# EAGLE design psvemmc-v20 (EAGLE 9.0.1)
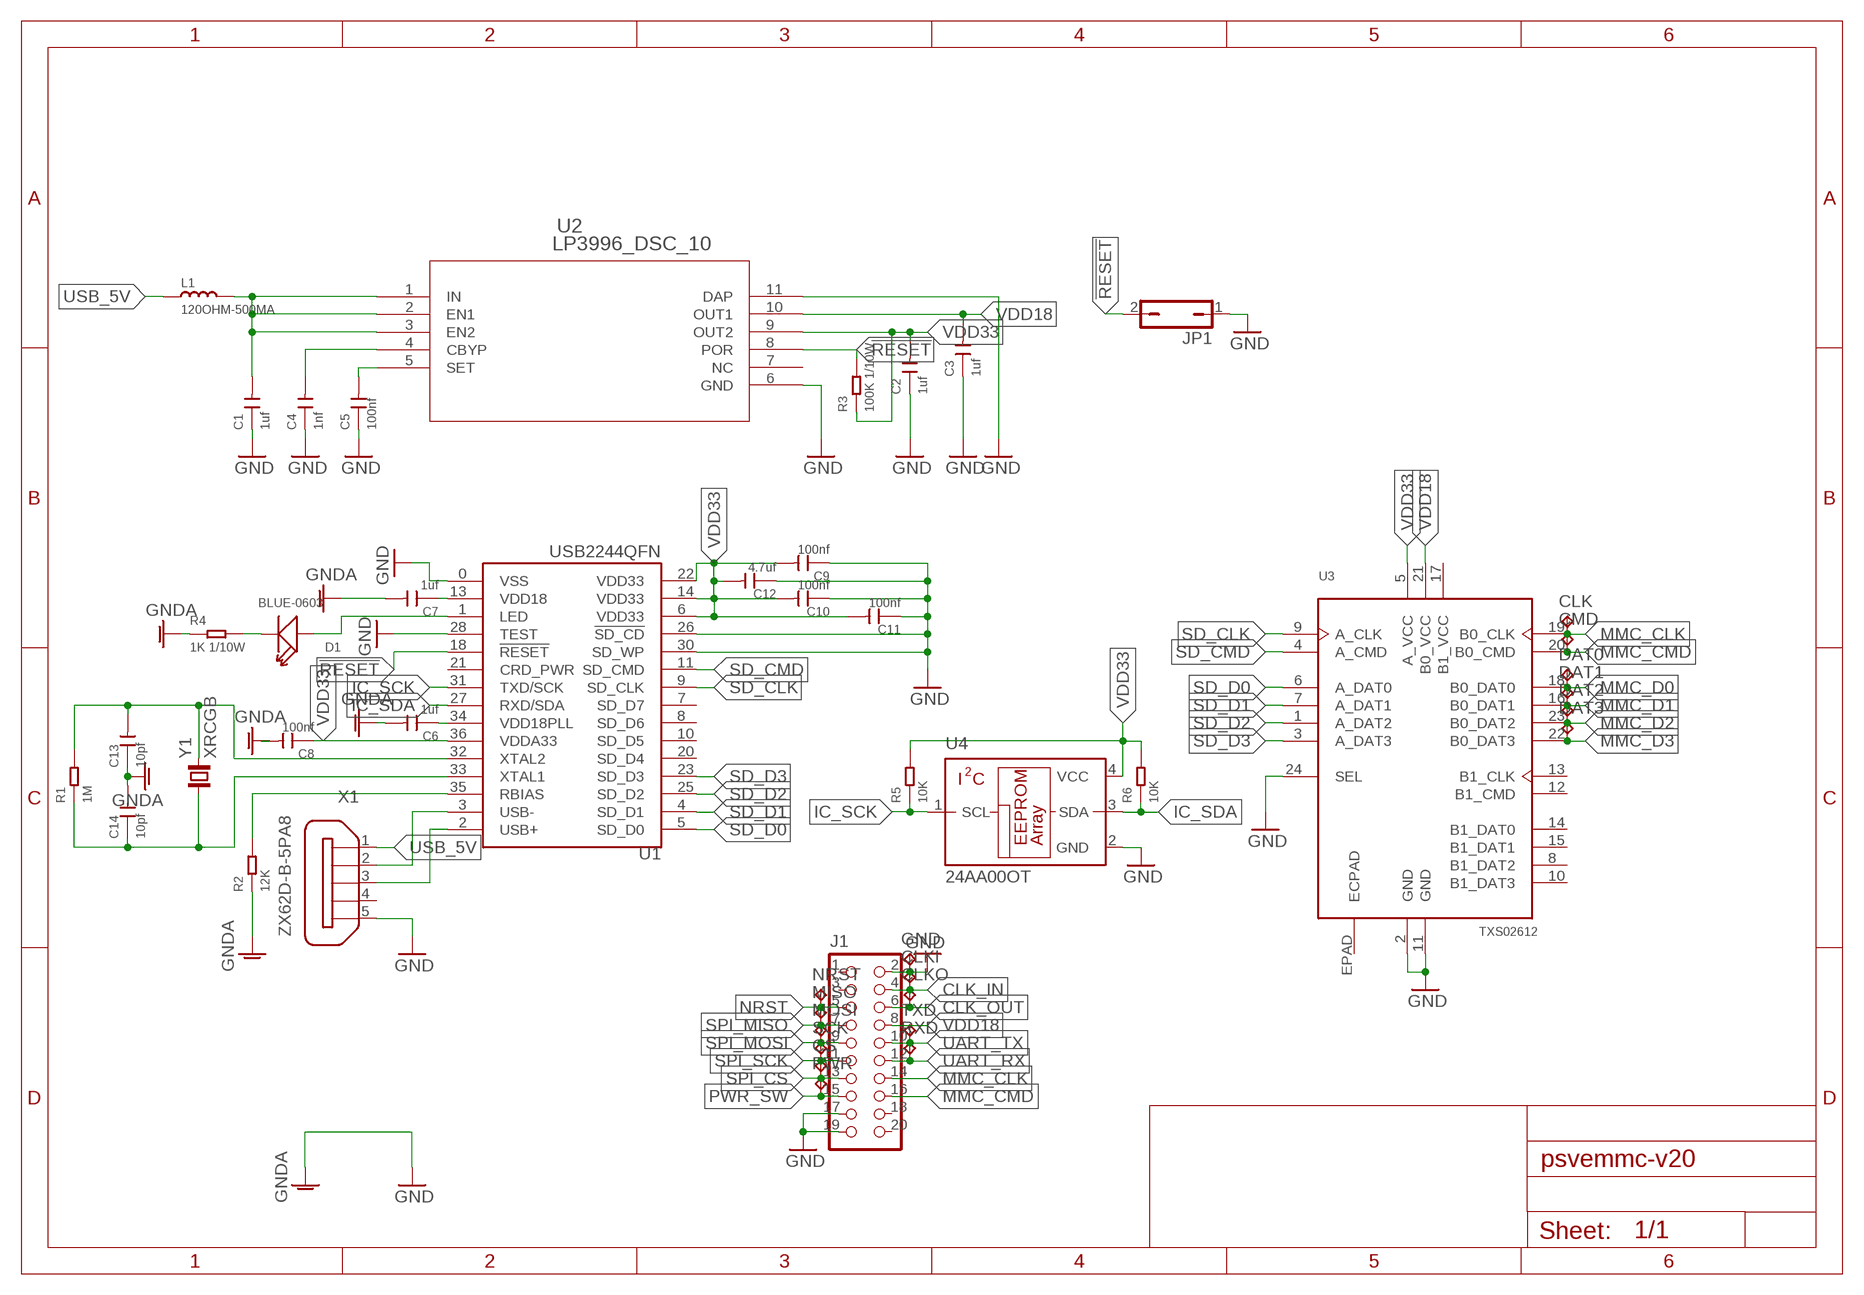
[diagram p0: schematic, sheet 1]

## Parts
C1  1uf  CERAMIC-1UF-25V-10%-X7R(0603)  [C0603]
C2  1uf  CERAMIC-1UF-25V-10%-X7R(0603)  [C0603]
C3  1uf  CERAMIC-1UF-25V-10%-X7R(0603)  [C0603]
C4  1nf  CERAMIC-1NF-50V-5%-C0G(0603)  [C0603]
C5  100nf  CERAMIC-100NF-50V-10%-X7R(0603)  [C0603]
C6  1uf  CERAMIC-1UF-25V-10%-X7R(0603)  [C0603]
C7  1uf  CERAMIC-1UF-25V-10%-X7R(0603)  [C0603]
C8  100nf  CERAMIC-100NF-50V-10%-X7R(0603)  [C0603]
C9  100nf  CERAMIC-100NF-50V-10%-X7R(0603)  [C0603]
C10  100nf  CERAMIC-100NF-50V-10%-X7R(0603)  [C0603]
C11  100nf  CERAMIC-100NF-50V-10%-X7R(0603)  [C0603]
C12  4.7uf  CERAMIC-4.7UF-10V-10%-X5R(0603)  [C0603]
C13  10pf  CERAMIC-10PF-50V-5%-NPO(0603)  [C0603]
C14  10pf  CERAMIC-10PF-50V-5%-NPO(0603)  [C0603]
CLK  TPTP10R  [TP10R]
CLKI  TPTP10R  [TP10R]
CLKO  TPTP10R  [TP10R]
CMD  TPTP10R  [TP10R]
CS  TPTP10R  [TP10R]
D1  BLUE-0603  SMD-LED-CLEAR-BLUE(0603)  [LED-0603]
DAT0  TPTP10R  [TP10R]
DAT1  TPTP10R  [TP10R]
DAT2  TPTP10R  [TP10R]
DAT3  TPTP10R  [TP10R]
GND  TPTP10R  [TP10R]
J1  CON_HEADER_2X10-SHROUDED  [PINSHRD_PTH_2X10]
JP1  JP1Q  [JP1]
L1  120OHM-500MA  SMD-FERRITE-CHIP-120-OHM-500MA(0603)  [L0603]
MISO  TPTP10R  [TP10R]
MOSI  TPTP10R  [TP10R]
NRST  TPTP10R  [TP10R]
PWR  TPTP10R  [TP10R]
R1  1M  SMD-RES-1M-1%-1/10W(0603)  [R0603]
R2  12K  SMD-RES-12K-1%-1/10W(0603)  [R0603]
R3  100K 1/10W  SMD-RES-100K-5%-1/10W(0603)  [R0603]
R4  1K 1/10W  SMD-RES-1K-5%-1/10W(0603)  [R0603]
R5  10K  SMD-RES-10K-1%-1/10W(0603)  [R0603]
R6  10K  SMD-RES-10K-1%-1/10W(0603)  [R0603]
RXD  TPTP10R  [TP10R]
SCK  TPTP10R  [TP10R]
TXD  TPTP10R  [TP10R]
U1  USB2244QFN  [QFN36]
U2  LP3996_DSC_10  [SDA10A]
U3  TXS02612  [S-PWQFN-N24]
U4  24AA00OT  [SOT23-5L]
X1  ZX62D-B-5PA8  [ZX62D-B-5PA8]
Y1  XRCGB  [XRCGB]

## Nets
!RESET: JP1.2 R3.2 U1.18(!RESET) U2.8(POR)
CLK_IN: CLKI.TP J1.4
CLK_OUT: CLKO.TP J1.6
GND [GND]: C1.1 C2.1 C3.1 C4.1 C5.1 C6.2 C7.2 C8.2 C9.1 C10.1 C11.1 C12.1 C13.1 C14.2 GND.TP J1.2 J1.17 J1.19 JP1.1 R2.1 R4.1 U1.0(VSS) U1.26(!SD_CD) U1.28(TEST) U1.30(SD_WP) U2.6(GND) U2.11(DAP) U3.2(GND) U3.11(GND) U3.24(SEL) U4.2(GND) X1.5 ; supply symbol labelled GNDA
IC_SCK: R5.1 U1.31(TXD/SCK) U4.1(SCL)
IC_SDA: R6.1 U1.27(RXD/SDA) U4.3(SDA)
LED: D1.+ U1.1(LED)
LED_M: D1.- R4.2
MMC_CLK: CLK.TP J1.14 U3.19(B0_CLK)
MMC_CMD: CMD.TP J1.16 U3.20(B0_CMD)
MMC_D0: DAT0.TP U3.18(B0_DAT0)
MMC_D1: DAT1.TP U3.16(B0_DAT1)
MMC_D2: DAT2.TP U3.23(B0_DAT2)
MMC_D3: DAT3.TP U3.22(B0_DAT3)
N$2: C4.2 U2.4(CBYP)
NRST: J1.5 NRST.TP
PWR_SW: J1.15 PWR.TP
RBIAS: R2.2 U1.35(RBIAS)
SD_CLK: U1.9(SD_CLK) U3.9(A_CLK)
SD_CMD: U1.11(SD_CMD) U3.4(A_CMD)
SD_D0: U1.5(SD_D0) U3.6(A_DAT0)
SD_D1: U1.4(SD_D1) U3.7(A_DAT1)
SD_D2: U1.25(SD_D2) U3.1(A_DAT2)
SD_D3: U1.23(SD_D3) U3.3(A_DAT3)
SET: C5.2 U2.5(SET)
SPI_CS: CS.TP J1.13
SPI_MISO: J1.7 MISO.TP
SPI_MOSI: J1.9 MOSI.TP
SPI_SCK: J1.11 SCK.TP
UART_RX: J1.12 RXD.TP
UART_TX: J1.10 TXD.TP
USB_5V: L1.1 X1.1
USB_M [USB]: U1.3(USB-) X1.2
USB_P [USB]: U1.2(USB+) X1.3
VDD5: C1.2 L1.2 U2.1(IN) U2.2(EN1) U2.3(EN2)
VDD18: C3.2 J1.8 U2.10(OUT1) U3.21(B0_VCC)
VDD18_PLL: C6.1 U1.34(VDD18PLL)
VDD18_USB: C7.1 U1.13(VDD18)
VDD33: C2.2 C8.1 C9.2 C10.2 C11.2 C12.2 R3.1 R5.2 R6.2 U1.6(VDD33) U1.14(VDD33) U1.22(VDD33) U1.36(VDDA33) U2.9(OUT2) U3.5(A_VCC) U4.4(VCC)
XTAL1: C14.1 R1.1 U1.33(XTAL1) Y1.1
XTAL2: C13.2 R1.2 U1.32(XTAL2) Y1.3
Unconnected: J1.1 J1.3 J1.18 J1.20 U1.7(SD_D7) U1.8(SD_D6) U1.10(SD_D5) U1.20(SD_D4) U1.21(CRD_PWR) U2.7(NC) U3.8(B1_DAT2) U3.10(B1_DAT3) U3.12(B1_CMD) U3.13(B1_CLK) U3.14(B1_DAT0) U3.15(B1_DAT1) X1.4 X1.S1 X1.S2 X1.S3 X1.S4

## Power pins joined to a net without a drawn wire
B1_VCC: U3.17(B1_VCC)
ECPAD: U3.EPAD(ECPAD)

## Library data of the parts
C1-C3 C6 C7 = Seeed-Capacitor:CERAMIC-1UF-25V-10%-X7R(0603): 302010139; MPN: CC0603KRX7R8BB105
C4 = Seeed-Capacitor:CERAMIC-1NF-50V-5%-C0G(0603): 302010341; MPN: GRM1885C1H102JA01D
C5 C8-C11 = Seeed-Capacitor:CERAMIC-100NF-50V-10%-X7R(0603): 302010138; MPN: CC0603KRX7R9BB104
C12 = Seeed-Capacitor:CERAMIC-4.7UF-10V-10%-X5R(0603): 302010111; MPN: CC0603KRX5R6BB475
C13 C14 = Seeed-Capacitor:CERAMIC-10PF-50V-5%-NPO(0603): 302010097; MPN: CC0603JRNPO9BN100
CLK CLKI CLKO CMD CS DAT0 DAT1-DAT3 GND MISO MOSI NRST PWR RXD SCK TXD = testpad:TP: Test pad
D1 = Seeed-LED:SMD-LED-CLEAR-BLUE(0603): 304090045; MPN: 19-217-BHC-ZL1M2RY-3T
J1 = dp_devices.v6:CON_HEADER_2X10
JP1 = jumper:JP1Q: JUMPER
L1 = Seeed-Inductor:SMD-FERRITE-CHIP-120-OHM-500MA(0603): 303030001; MPN: BLM18AG121SN1D
R1 = Seeed-Resistor:SMD-RES-1M-1%-1/10W(0603): 301010151; MPN: RC0603FR-071ML
R2 = Seeed-Resistor:SMD-RES-12K-1%-1/10W(0603): 301010102; MPN: RC0603FR-0712KL
R3 = Seeed-Resistor:SMD-RES-100K-5%-1/10W(0603): 301010089; MPN: RC0603JR-07100KL
R4 = Seeed-Resistor:SMD-RES-1K-5%-1/10W(0603): 301010291; MPN: RC0603JR-071KL
R5 R6 = Seeed-Resistor:SMD-RES-10K-1%-1/10W(0603): 301010299; MPN: RC0603FR-0710KL
U1 = USB2244:USB2244: USB2244/USB2244I
U2 = LP3996:LP3996_DSC_10; BASE_PN: LP3996; COMP: TypeLDO; LIBRARY: ReferenceLP3996SD; PARTNUMBER: LP3996SD0833; PIN: Count10; SYMBOL: NameLP3996SD0833; TYPE: LP3996SD0833; VENDOR: NationalSemiconductor; VERSION: 1
U3 = TXS02612:TXS02612
U4 = microchip:24*00: Serial EEPROM 128 bit, I2C (AA = 1.8 V/LC = 2.5 V/C = 5.0 V); MF: MICROCHIP; MPN: 24AA00T-I/OTG; OC_FARNELL: 1331264; OC_NEWARK: 89H3038
X1 = zx62d-b-5pa8-oshpark_10:ZX62D-B-5PA8: Micro USB Type B Connector - Standard, Shell Through Hole Source: http://www.hirose.co.jp/cataloge_hp/ed_ZX_20140804.pdf; MF: Hirose; MPN: ZX62D-B-5PA8; OC_FARNELL: 2300438; OC_NEWARK: 69W0712
Y1 = crystal:XRCGB: CRYSTAL

## Board
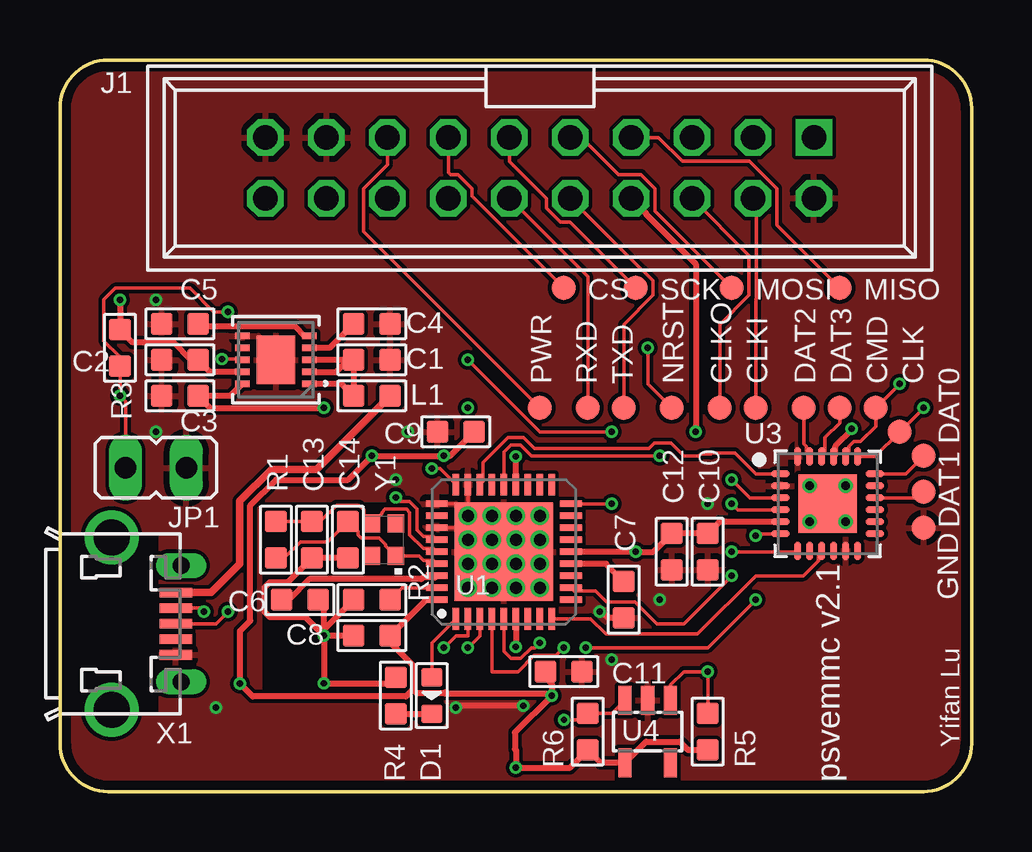
[diagram p1: board, top side]
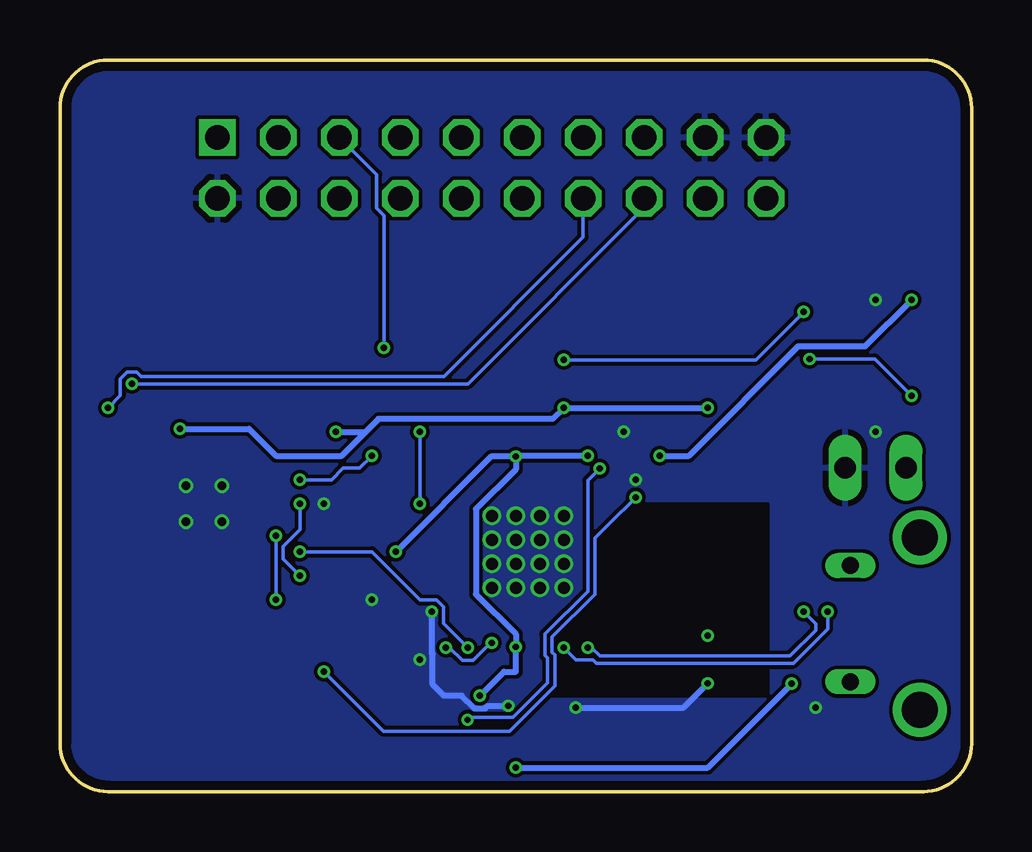
[diagram p2: board, bottom side, seen from below]

Size 38 x 30.5 mm. Coordinates in mm from the lower left corner, seen from the top.
Outline: 0,20.5 0,2
Outline: 0,2 0,28.5 arc-90 2,30.5 36,30.5 arc-90 38,28.5 38,2 arc-90 36,0 2,0 arc-90 0,2
Copper layers (1*16): Top 0.035559375mm / dielectric 1.6mm / Bottom 0.035559375mm
Design rules "oshpark-2layer *": minimum track width 6mil, minimum drill 10mil, track to track 6mil, track to pad 6mil, pad to pad 6mil, via to via 6mil, smd to smd 6mil, copper to edge 15mil, drill to drill 6mil, minimum pad ring 5mil, minimum via ring 5mil, stop-mask expansion 2.5mil, vias tented up to drill 0mil, thermal gap 10mil
tKeepout: area 33,2 to 36,9

### Footprints (pad centres in the part's own frame; a part is rotated, then mirrored left to right if it is on the bottom)
C0603 = smd 0.889 x 0.889: 1 0,0.762; 2 0,-0.762
TP10R = smd 1 x 1: TP 0,0
LED-0603 = smd 0.762 x 0.889: + -0.762,0; - 0.762,0
PINSHRD_PTH_2X10 = drill 1.016 square: 1 -11.43,-1.27 | drill 1.016 octagon: 2 -11.43,1.27; 3 -8.89,-1.27; 4 -8.89,1.27; 5 -6.35,-1.27; 6 -6.35,1.27; 7 -3.81,-1.27; 8 -3.81,1.27; 9 -1.27,-1.27; 10 -1.27,1.27; 11 1.27,-1.27; 12 1.27,1.27; 13 3.81,-1.27; 14 3.81,1.27; 15 6.35,-1.27; 16 6.35,1.27; 17 8.89,-1.27; 18 8.89,1.27; 19 11.43,-1.27; 20 11.43,1.27
JP1 = drill 0.914 long: 1 0,-1.27; 2 0,1.27
L0603 = smd 0.889 x 0.889: 1 -0.762,0; 2 0.762,0
R0603 = smd 0.889 x 0.889: 1 0,0.762; 2 0,-0.762
QFN36 = smd 4.1 x 4.1: 0 0,0 | smd 0.28 x 0.9: 1 -2,-2.8; 2 -1.5,-2.8; 3 -1,-2.8; 4 -0.5,-2.8; 5 0,-2.8; 6 0.5,-2.8; 7 1,-2.8; 8 1.5,-2.8; 9 2,-2.8; 19 2,2.8; 20 1.5,2.8; 21 1,2.8; 22 0.5,2.8; 23 0,2.8; 24 -0.5,2.8; 25 -1,2.8; 26 -1.5,2.8; 27 -2,2.8 | smd 0.9 x 0.28: 10 2.8,-2; 11 2.8,-1.5; 12 2.8,-1; 13 2.8,-0.5; 14 2.8,0; 15 2.8,0.5; 16 2.8,1; 17 2.8,1.5; 18 2.8,2; 28 -2.8,2; 29 -2.8,1.5; 30 -2.8,1; 31 -2.8,0.5; 32 -2.8,0; 33 -2.8,-0.5; 34 -2.8,-1; 35 -2.8,-1.5; 36 -2.8,-2
SDA10A = smd 0.61 x 0.254: 1 -1.397,1; 2 -1.397,0.5; 3 -1.397,0; 4 -1.397,-0.5; 5 -1.397,-1; 6 1.397,-1; 7 1.397,-0.5; 8 1.397,0; 9 1.397,0.5; 10 1.397,1 | smd 1.6 x 2.007: 11 0,0
S-PWQFN-N24 = smd 0.78 x 0.28: 1 -1.975,1.25; 2 -1.975,0.75; 3 -1.975,0.25; 4 -1.975,-0.25; 5 -1.975,-0.75; 6 -1.975,-1.25; 13 1.975,-1.25; 14 1.975,-0.75; 15 1.975,-0.25; 16 1.975,0.25; 17 1.975,0.75; 18 1.975,1.25 | smd 0.28 x 0.78: 7 -1.25,-1.975; 8 -0.75,-1.975; 9 -0.25,-1.975; 10 0.25,-1.975; 11 0.75,-1.975; 12 1.25,-1.975; 19 1.25,1.975; 20 0.75,1.975; 21 0.25,1.975; 22 -0.25,1.975; 23 -0.75,1.975; 24 -1.25,1.975 | smd 2.45 x 2.45: EPAD 0,0
SOT23-5L = smd 0.55 x 1.2: 1 -0.95,-1.3; 2 0,-1.3; 3 0.95,-1.3; 4 0.95,1.3; 5 -0.95,1.3
ZX62D-B-5PA8 = smd 1.35 x 0.4: 1 4.825,1.3; 2 4.825,0.65; 3 4.825,0; 4 4.825,-0.65; 5 4.825,-1.3 | drill 1.5: S1 2.15,-3.6; S2 2.15,3.6 | drill 0.7 long: S3 5.05,2.425; S4 5.05,-2.425
XRCGB = smd 0.75 x 0.7: 1 -0.675,-0.5; 2 0.675,-0.5; 3 0.675,0.5; 4 -0.675,0.5

### Placement (x,y rotation side)
C1  13,18 270 top
C2  5,18 90 top
C3  5,16.5 90 top
C4  13,19.5 270 top
C5  5,19.5 90 top
C6  10,8 90 top
C7  23.5,8 0 top
C8  13,6.5 270 top
C9  16.5,15 90 top
C10  27,10 180 top
C11  21,5 270 top
C12  25.5,10 180 top
C13  10.5,10.5 180 top
C14  12,10.5 0 top
CLK  35,15 0 top
CLKI  29,16 0 top
CLKO  27.5,16 0 top
CMD  34,16 0 top
CS  21,21 270 top
D1  15.5,4 270 top
DAT0  36,14 0 top
DAT1  36,12.5 0 top
DAT2  31,16 0 top
DAT3  32.5,16 0 top
GND  36,11 0 top
J1  20,26 180 top
JP1  4,13.5 90 top
L1  13,16.5 180 top
MISO  32.5,21 270 top
MOSI  28,21 270 top
NRST  25.5,16 0 top
PWR  20,16 0 top
R1  9,10.5 180 top
R2  13,8 90 top
R3  2.5,18.5 0 top
R4  14,4 0 top
R5  27,2.5 0 top
R6  22,2.5 0 top
RXD  22,16 180 top
SCK  24,21 270 top
TXD  23.5,16 180 top
U1  18.5,10 0 top
U2  9,18 180 top
U3  32,12 0 top
U4  24.5,2.5 180 top
X1  0,7 0 top
Y1  13.5,10.5 90 top

### Tracks (layer width: path | path; a pad name or v marks a point on that pad's centre or on a via)
!RESET  (via drill 0.25)
  Top 0.152: U2.8 7.57,18.03 v6.75,18.03 | v2.5,16.5 R3.2 | U1.18 v23,12 | v7,20 6.41,20 5.43,20.98 2.3,20.98 1.83,20.51 1.83,18.79 2.5,18.11 v2.5,16.5 | v23,15 20,15 v17,18 | JP1.2 2.73,16.27 v2.5,16.5
  Bottom 0.152: v6.75,18.03 4.03,18.03 v2.5,16.5 | v23,15 v23,12 | v17,18 9,18 v7,20
CLK_IN
  Top 0.152: CLKI.TP 29,20.54 29.03,20.57 29.03,24.59 J1.4
CLK_OUT
  Top 0.152: CLKO.TP 27.5,19.47 28.73,20.7 28.73,22.35 J1.6
GND  (via drill 0.25, 0.35, 0.5)
  Top 0.152: U1.28 17,12 U1.26 | U1.30 16.5,11 v17,10.5
  Top 0.254: U1.0 v19,9.5 | v32.75,12.75 v31.25,12.75 | v31.25,11.25 v32.75,11.25 | C6.2 11,7.76 v11,6.5 | R2.1 11,6.76 v11,6.5 | C8.2 v11,6.5 | 13.74,4.5 R4.1 13.75,4.51 v11,4.51 v11,6.5 | C7.2 22.86,7.24 22.72,7.37 22.63,7.37 v22.5,7.5 | C14.2 C13.1 9.49,8.72 8.74,8.72 8.51,8.49 8.51,7.5 8.74,7.28 10.22,7.28 v11,6.5 | v19.31,3.57 16.57,3.57 v16.5,3.5
  Bottom 0.254: 11,4.64 v11,4.51 12.01,3.5 v16.5,3.5 | v22.5,7.5 22.5,5.75 22.47,5.72 22.47,4.47 22,4 21.25,4 20.72,3.47 20.28,3.47 20.18,3.57 v19.31,3.57
  other vias: 17,11.5 18,11.5 19,11.5 20,11.5 20,10.5 19,10.5 18,10.5 17,9.5 18,9.5 20,9.5 20,8.5 19,8.5 18,8.5 17,8.5 14,13 4,20.5 14.5,15 23,5.5 6.5,3.5 4,15 25,8 27,12
  pour Top (rank 5): 0,30.5 0,0 38,0 38,30.5
  pour Bottom: 0,30.5 0,0 38,0 38,30.5
  cutout Bottom (rank 3): 8.5,12 14.5,12 14.5,7 17.5,7 17.5,4 8.5,4
  cutout Top: 8.5,4 8.5,12 14.5,12 14.5,7 17.5,7 17.5,4
IC_SCK  (via drill 0.25)
  Top 0.152: U1.31 15.57,10.63 15.15,10.63 14.88,10.9 14.88,11.77 14.57,12.08 14.18,12.08 v14,12.26 | R5.1 v27,5 26,5 25.45,4.45 U4.1
  Bottom 0.152: v27,5 24.51,2.51 19.25,2.51 17.37,4.4 17.37,5.69 17.48,5.8 17.48,6 17.48,6.44 15.7,8.23 15.7,10.57 15.13,11.13 v14,12.26
IC_SDA  (via drill 0.25)
  Top 0.152: v21,3 21.73,3 R6.1 23.01,3.26 U4.3 | U1.27 15.83,13.47 v15.5,13.47
  Bottom 0.152: v21,3 20.91,3.09 19.11,3.09 17.68,4.52 17.68,5.56 17.79,5.67 17.79,6.57 16,8.35 16,12.97 v15.5,13.47
LED
  Top 0.152: U1.1 15.5,6.2 D1.+
LED_M
  Top 0.254: R4.2 D1.-
MMC_CLK  (via drill 0.25)
  Top 0.152: U3.19 33.98,13.97 CLK.TP v36,16
  Bottom 0.152: v36,16 35.48,16.52 35.48,17.2 35.2,17.48 34.8,17.48 34.62,17.3 22,17.3 16.19,23.11 J1.14
MMC_CMD  (via drill 0.25)
  Top 0.152: U3.20 32.88,14.11 32.88,14.38 33.1,14.59 33.37,14.59 34,15.22 CMD.TP v35,17
  Bottom 0.152: v35,17 21,17 13.65,24.35 J1.16
MMC_D0
  Top 0.152: U3.18 35.25,13.25 DAT0.TP
MMC_D1
  Top 0.152: U3.16 35.75,12.25 DAT1.TP
MMC_D2
  Top 0.152: U3.23 31.12,14.11 31.12,14.38 31,14.5 DAT2.TP
MMC_D3
  Top 0.152: U3.22 31.88,14.11 31.88,14.76 32.5,15.38 DAT3.TP
N$2
  Top 0.254: C4.2 11.24,18.5 U2.4
NRST  (via drill 0.25)
  Top 0.152: NRST.TP 24.5,17 v24.5,18.5
  Bottom 0.152: v24.5,18.5 24.5,24.02 24.8,24.32 24.8,25.72 J1.5
PWR_SW
  Top 0.152: J1.15 13.65,26.13 12.66,25.14 12.66,23.34 PWR.TP
RBIAS
  Top 0.152: R2.2 14.26,8.5 U1.35
SD_CLK
  Top 0.152: U1.9 22.12,7.2 22.75,6.57 26.57,6.57 29,9 31,9 31.62,9.62 31.62,9.89 U3.9
SD_CMD  (via drill 0.25)
  Top 0.152: U3.4 28.25,11.75 v28,12 | v28,9 26,7 24.89,7 23.97,7.91 22.77,7.91 22.31,8.37 21.43,8.37 U1.11
  Bottom 0.152: v28,12 28,10.92 28.7,10.22 28.7,9.7 v28,9
SD_D0  (via drill 0.25)
  Top 0.152: U1.5 18.52,7.18 18.52,5.83 | v29,10.67 29.08,10.75 U3.6 | 18.52,6 18.52,5.83 | 18.52,5.83 18.8,5.55 19.2,5.55 19.65,6 19.8,6 v20,6.2 | v21.92,6 27,6 v29,8
  Bottom 0.152: v29,8 v29,10.67 | v20,6.2 20.05,6.2 20.78,5.47 21.22,5.47 21.75,6 v21.92,6
SD_D1  (via drill 0.25)
  Top 0.152: U3.7 30.73,10 v28,10 | v21,6 20.67,5.67 19.76,5.67 19.09,5 18,5 U1.4
  Bottom 0.152: v28,10 25,10 22.98,7.98 22.3,7.98 22.02,7.7 22.02,7.02 v21,6
SD_D2
  Top 0.152: U3.1 29,13.25 28.13,14.12 27.19,14.12 27.14,14.07 26.71,14.07 26.64,14 26,14 25.47,14.53 24.78,14.53 24.55,14.3 19.77,14.3 19.33,14.75 18.67,14.75 17.63,13.71 17.63,12.93 U1.25
SD_D3  (via drill 0.25)
  Top 0.152: v25,14 19.65,14 19.2,14.45 18.8,14.45 18.52,14.16 18.52,12.82 U1.23 | U3.3 28.75,12.25 v28,13
  Bottom 0.152: v28,13 26.68,13 26.2,13.48 25.52,13.48 v25,14
SET
  Top 0.254: U2.5 10.2,19 9.79,19.41 5.86,19.41 C5.2
SPI_CS
  Top 0.152: J1.13 16.19,25.81 16.28,25.72 16.6,25.72 17.18,25.14 17.18,24.82 CS.TP
SPI_MISO
  Top 0.152: MISO.TP 29.88,23.62 29.88,25.14 28.74,26.28 25.94,26.28 24.95,27.27 J1.7
SPI_MOSI
  Top 0.152: J1.9 21.73,27.27 23.28,25.72 24.22,25.72 24.8,25.14 24.8,24.2 MOSI.TP
SPI_SCK
  Top 0.152: J1.11 18.73,26.27 20.28,24.72 20.28,24.32 20.86,23.74 21.26,23.74 SCK.TP
UART_RX
  Top 0.152: RXD.TP 22,21.46 J1.12
UART_TX
  Top 0.152: TXD.TP 23.5,19.47 24.73,20.7 24.73,21.3 24.3,21.73 24.27,21.73 J1.10
USB_5V
  Top 0.305: X1.1 6.3,8.3 7.5,9.49 7.5,12.11 8.82,13.43 10.69,13.43 11.63,14.37 | 11.63,14.37 11.26,14 | 11.63,14.37 L1.1
USB_M  (via drill 0.25)
  Top 0.152: v17,6 17.5,6.5 U1.3 | X1.2 5.85,7.65 v6,7.5
  Bottom 0.152: v17,6 16.5,5.5 15.78,5.5 15.63,5.35 7.44,5.35 | 7.44,5.35 | v6,7.5 6,6.78 7.44,5.35
USB_P  (via drill 0.25)
  Top 0.152: v16,6 16.5,6.5 17,6.5 U1.2 | X1.3 6.5,7 v7,7.5
  Bottom 0.152: v16,6 15.85,6 15.5,5.65 7.56,5.65 6.5,6.72 6.5,7 v7,7.5
VDD5
  Top 0.254: U2.1 11.74,17 L1.2 C1.2 12,18 | 12,18 U2.3 | U2.2 11.5,17.5 12,18
VDD18  (via drill 0.25)
  Top 0.254: U2.10 7.1,16.5 C3.2 6.26,16 v11,16 | U3.21 32.33,14.06 32.33,14.4 33,15.07 v33,15.12 | J1.8 24.45,24.09 24.45,24.05 26.5,22 v26.5,15
  Bottom 0.254: v11,16 v17,16 17.47,15.53 24.72,15.53 25.25,15 | 25.25,15 26.25,14 29,14 30.12,15.12 v33,15.12 | v26.5,15 25.25,15
VDD18_PLL
  Top 0.254: 9.54,8 C6.1 9.54,8 | U1.34 15.62,8.92 15.13,8.92 15.07,8.86 10.4,8.86 9.54,8
VDD18_USB
  Top 0.254: C7.1 22.76,9.5 U1.13
VDD33  (via drill 0.25)
  Top 0.254: U2.9 6.26,17.5 C2.2 5.46,18 4.73,18.72 3.04,18.72 R3.1 v2.5,20.5 | U1.36 15.26,8 C8.1 13.76,6.22 14.72,5.26 14.72,4.27 | U1.14 v24,10 24.74,10 C12.2 C10.2 27.49,11.25 U3.5 | U1.6 v19,6.04 | 20.12,4.88 20,4.76 | 20.12,4.88 C11.2 | U1.22 v19,13.96 | 14.72,4.27 14.42,3.97 8.03,3.97 v7.5,4.5 7.5,6.69 7.93,7.12 7.93,11.93 9,13 12,13 v13,14 v16,14 16.26,14 C9.2 | 16.05,4.15 16,4.1 | 16,4.1 14.89,4.1 14.72,4.27 | v20.5,4 20.5,4.5 20.12,4.88 | v20.5,4 18.97,2.47 18.97,1.78 19,1.75 v19,1 21.26,1 R6.2 22.54,1.2 U4.4 24.43,2.08 25.84,2.08 26.18,1.74 R5.2 | 16,4.1 20.4,4.1 v20.5,4
  Bottom 0.254: v7.5,4.5 11,1 v19,1 | v2.5,20.5 4.43,18.57 7.22,18.57 11.79,14 v13,14 | v19,13.96 20.04,13.96 v24,10 | v19,13.96 19,13.43 20.66,11.77 20.66,8.23 19,6.57 v19,6.04 19,5 19.5,5 v20.5,4 | v16,14 18.96,14 v19,13.96
XTAL1
  Top 0.152: U1.33 15.57,9.63 15.15,9.63 14.96,9.82 Y1.1 13.58,10.25 13.58,10.29 13.3,10.57 12.55,10.57 12.42,10.71 12.42,10.84 C14.1 11.15,10.41 10.03,10.41 9.35,9.74 R1.1
XTAL2
  Top 0.152: U1.32 15.57,10.13 15.15,10.13 14.58,10.71 14.58,11.64 14.45,11.78 13.55,11.78 13.42,11.64 13.42,11.6 Y1.3 12.67,11.5 12.67,11.74 12.47,11.94 11.53,11.94 10.85,11.26 C13.2 R1.2

### Text on the board
tPlace: psvemmc v2.1 | Yifan Lu